# Altium project Motherboard_trimmed.PrjPcb
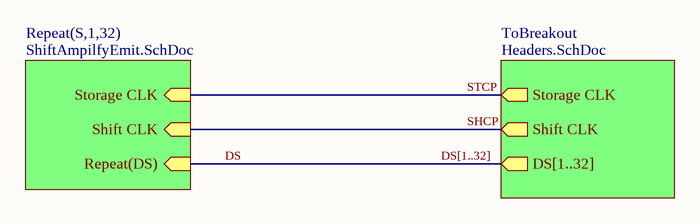
[diagram p0: Motherboard_Top_trimmed.SchDoc]
3 sheets, 610 parts. Net scope: hierarchical (ports join the sheet entries above them; power ports are global).
Board file: Motherboard_PCB_Trimmed.PcbDoc
Sheets:
  Motherboard_Top_trimmed.SchDoc
    S1 = ShiftAmpilfyEmit.SchDoc
    S2 = ShiftAmpilfyEmit.SchDoc
    S3 = ShiftAmpilfyEmit.SchDoc
    S4 = ShiftAmpilfyEmit.SchDoc
    S5 = ShiftAmpilfyEmit.SchDoc
    S6 = ShiftAmpilfyEmit.SchDoc
    S7 = ShiftAmpilfyEmit.SchDoc
    S8 = ShiftAmpilfyEmit.SchDoc
    S9 = ShiftAmpilfyEmit.SchDoc
    S10 = ShiftAmpilfyEmit.SchDoc
    S11 = ShiftAmpilfyEmit.SchDoc
    S12 = ShiftAmpilfyEmit.SchDoc
    S13 = ShiftAmpilfyEmit.SchDoc
    S14 = ShiftAmpilfyEmit.SchDoc
    S15 = ShiftAmpilfyEmit.SchDoc
    S16 = ShiftAmpilfyEmit.SchDoc
    S17 = ShiftAmpilfyEmit.SchDoc
    S18 = ShiftAmpilfyEmit.SchDoc
    S19 = ShiftAmpilfyEmit.SchDoc
    S20 = ShiftAmpilfyEmit.SchDoc
    S21 = ShiftAmpilfyEmit.SchDoc
    S22 = ShiftAmpilfyEmit.SchDoc
    S23 = ShiftAmpilfyEmit.SchDoc
    S24 = ShiftAmpilfyEmit.SchDoc
    S25 = ShiftAmpilfyEmit.SchDoc
    S26 = ShiftAmpilfyEmit.SchDoc
    S27 = ShiftAmpilfyEmit.SchDoc
    S28 = ShiftAmpilfyEmit.SchDoc
    S29 = ShiftAmpilfyEmit.SchDoc
    S30 = ShiftAmpilfyEmit.SchDoc
    S31 = ShiftAmpilfyEmit.SchDoc
    S32 = ShiftAmpilfyEmit.SchDoc
    ToBreakout = Headers.SchDoc

## Sheet Motherboard_Top_trimmed.SchDoc: Interact Lab Motherboard
size A4; DrawnBy: Ben Kazemi; Engineer: Ben Kazemi; DocumentNumber: 1; Revision: 1; SheetNumber: 1; SheetTotal: 3; Number: Top; DocumentName: Interact Lab Motherboard; ProjectName: Interact Lab Motherboard

### Sub-sheets
Repeat(S,1,32) = ShiftAmpilfyEmit.SchDoc: Storage CLK (in), Shift CLK (in), Repeat(DS) (in)
ToBreakout = Headers.SchDoc: Storage CLK (out), Shift CLK (out), DS[1..32] (out)

### Nets
DS: sheet Repeat(S,1,32)/Repeat(DS)
SHCP: sheet Repeat(S,1,32)/Shift CLK, sheet ToBreakout/Shift CLK
STCP: sheet Repeat(S,1,32)/Storage CLK, sheet ToBreakout/Storage CLK

### Buses and harness runs
bus DS[1..32] = sheet ToBreakout/DS[1..32]

## Sheet ShiftAmpilfyEmit.SchDoc: Interact Lab Motherboard
size A4; DrawnBy: Ben Kazemi; DocumentNumber: 2; SheetNumber: 2; SheetTotal: 3; Number: Logic and Amplification Stage
Used 32 times, as channels S1, S2, S3, S4, S5, S6, S7, S8, S9, S10, S11, S12, S13, S14, S15, S16, S17, S18, S19, S20, S21, S22, S23, S24, S25, S26, S27, S28, S29, S30, S31, S32. Parts and nets are listed once, with the designators drawn on the sheet.
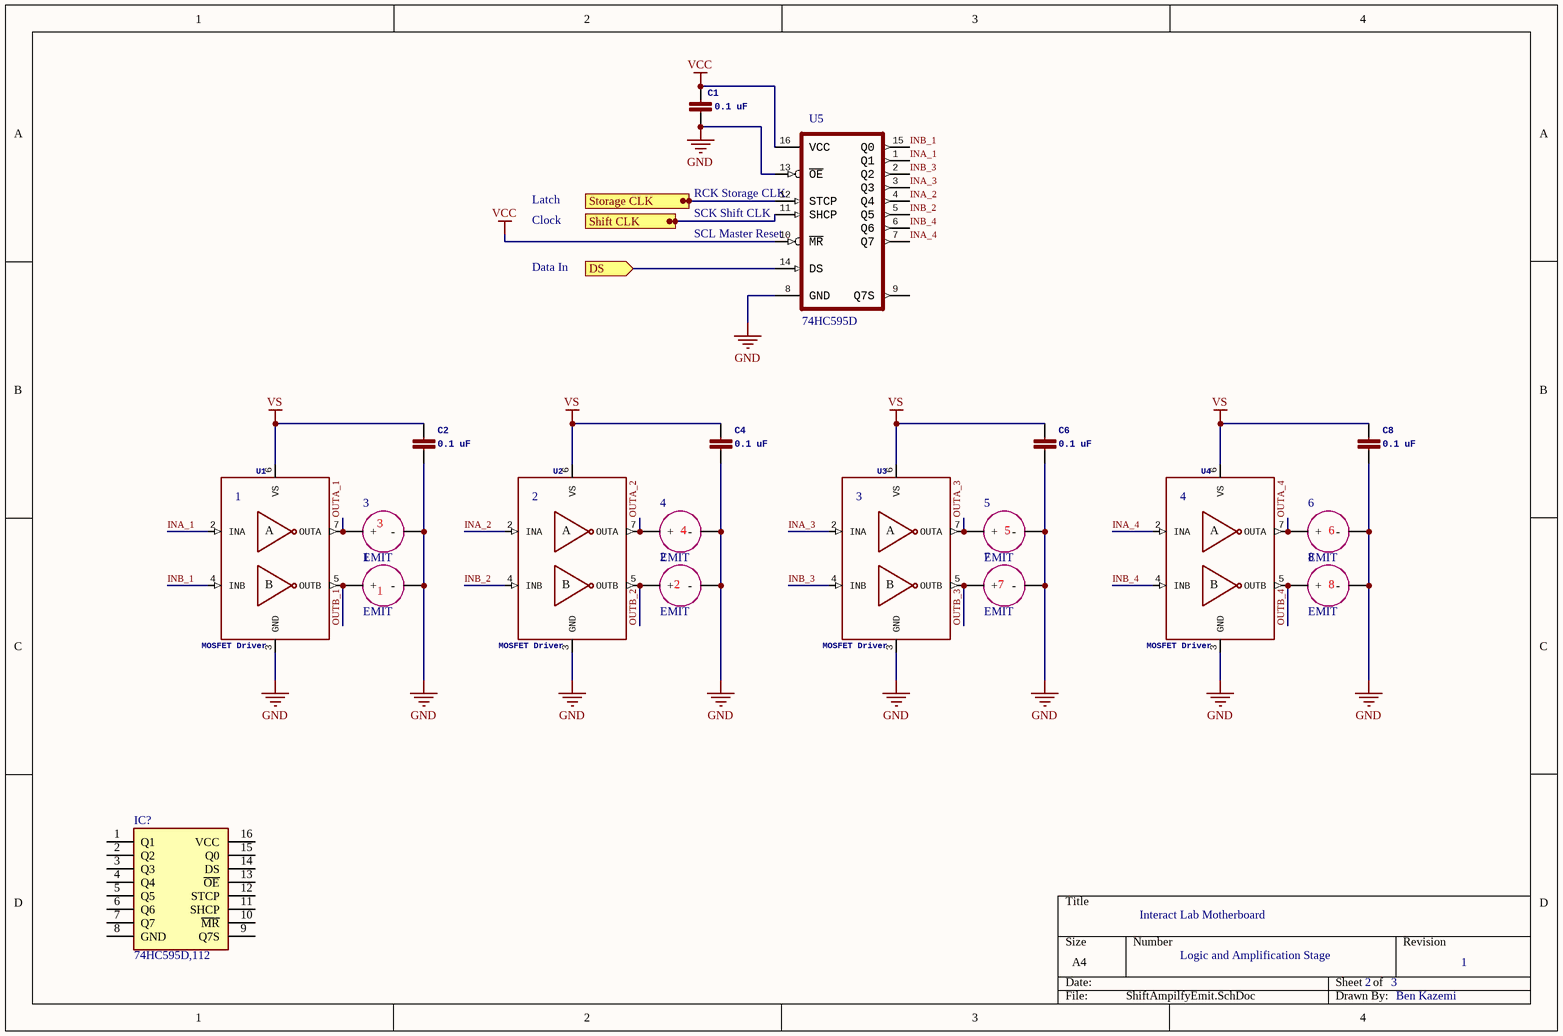
[diagram p1: ShiftAmpilfyEmit.SchDoc]

### Parts
1  EMIT  [TRANSDUCER]
2  EMIT  [TRANSDUCER]
3  EMIT  [TRANSDUCER]
4  EMIT  [TRANSDUCER]
5  EMIT  [TRANSDUCER]
6  EMIT  [TRANSDUCER]
7  EMIT  [TRANSDUCER]
8  EMIT  [TRANSDUCER]
C1  0.1 uF  [CAP0805]
C2  0.1 uF  [CAP0805]
C4  0.1 uF  [CAP0805]
C6  0.1 uF  [CAP0805]
C8  0.1 uF  [CAP0805]
IC?  74HC595D,112  [SOIC127P600X175-16N]
U1  MOSFET Driver  [MIC4127YME]
U2  MOSFET Driver  [MIC4127YME]
U3  MOSFET Driver  [MIC4127YME]
U4  MOSFET Driver  [MIC4127YME]
U5  74HC595D  [74*959D]

### Ports
DS (in), Shift CLK (in), Storage CLK (in)

### Nets
GND: 1.- 2.- 3.- 4.- 5.- 6.- 7.- 8.- C1.2 C2.2 C4.2 C6.2 C8.2 U1.3(GND) U2.3(GND) U3.3(GND) U4.3(GND) U5.8(GND) U5.13(~{OE})
VCC: C1.1 U5.10(~{MR}) U5.16(VCC)
VS: C2.1 C4.1 C6.1 C8.1 U1.6(VS) U2.6(VS) U3.6(VS) U4.6(VS)
DS: U5.14(DS) ; port DS
INA_1: U1.2(INA) U5.1(Q1)
INA_2: U2.2(INA) U5.4(Q4)
INA_3: U3.2(INA) U5.3(Q3)
INA_4: U4.2(INA) U5.7(Q7)
INB_1: U1.4(INB) U5.15(Q0)
INB_2: U2.4(INB) U5.5(Q5)
INB_3: U3.4(INB) U5.2(Q2)
INB_4: U4.4(INB) U5.6(Q6)
OUTA_1: 3.+ U1.7(OUTA)
OUTA_2: 4.+ U2.7(OUTA)
OUTA_3: 5.+ U3.7(OUTA)
OUTA_4: 6.+ U4.7(OUTA)
OUTB_1: 1.+ U1.5(OUTB)
OUTB_2: 2.+ U2.5(OUTB)
OUTB_3: 7.+ U3.5(OUTB)
OUTB_4: 8.+ U4.5(OUTB)
Shift CLK: U5.11(SHCP) ; port Shift CLK
Storage CLK: U5.12(STCP) ; port Storage CLK

Not connected (* = marked no-connect by the designer): IC? 1(Q1) 2(Q2) 3(Q3) 4(Q4) 5(Q5) 6(Q6) 7(Q7) 8(GND) 9(Q7S) 10(~{MR}) 11(SHCP) 12(STCP) 13(~{OE}) 14(DS) 15(Q0) 16(VCC); U5 9(Q7S)

### Channels
S1: designators end in A; ports DS=DS1 Shift CLK=SHCP Storage CLK=STCP
S2: designators end in B; ports DS=DS2 Shift CLK=SHCP Storage CLK=STCP
S3: designators end in C; ports DS=DS3 Shift CLK=SHCP Storage CLK=STCP
S4: designators end in D; ports DS=DS4 Shift CLK=SHCP Storage CLK=STCP
S5: designators end in E; ports DS=DS5 Shift CLK=SHCP Storage CLK=STCP
S6: designators end in F; ports DS=DS6 Shift CLK=SHCP Storage CLK=STCP
S7: designators end in G; ports DS=DS7 Shift CLK=SHCP Storage CLK=STCP
S8: designators end in H; ports DS=DS8 Shift CLK=SHCP Storage CLK=STCP
S9: designators end in I; ports DS=DS9 Shift CLK=SHCP Storage CLK=STCP
S10: designators end in J; ports DS=DS10 Shift CLK=SHCP Storage CLK=STCP
S11: designators end in K; ports DS=DS11 Shift CLK=SHCP Storage CLK=STCP
S12: designators end in L; ports DS=DS12 Shift CLK=SHCP Storage CLK=STCP
S13: designators end in M; ports DS=DS13 Shift CLK=SHCP Storage CLK=STCP
S14: designators end in N; ports DS=DS14 Shift CLK=SHCP Storage CLK=STCP
S15: designators end in O; ports DS=DS15 Shift CLK=SHCP Storage CLK=STCP
S16: designators end in P; ports DS=DS16 Shift CLK=SHCP Storage CLK=STCP
S17: designators end in Q; ports DS=DS17 Shift CLK=SHCP Storage CLK=STCP
S18: designators end in R; ports DS=DS18 Shift CLK=SHCP Storage CLK=STCP
S19: designators end in S; ports DS=DS19 Shift CLK=SHCP Storage CLK=STCP
S20: designators end in T; ports DS=DS20 Shift CLK=SHCP Storage CLK=STCP
S21: designators end in U; ports DS=DS21 Shift CLK=SHCP Storage CLK=STCP
S22: designators end in V; ports DS=DS22 Shift CLK=SHCP Storage CLK=STCP
S23: designators end in W; ports DS=DS23 Shift CLK=SHCP Storage CLK=STCP
S24: designators end in X; ports DS=DS24 Shift CLK=SHCP Storage CLK=STCP
S25: designators end in Y; ports DS=DS25 Shift CLK=SHCP Storage CLK=STCP
S26: designators end in Z; ports DS=DS26 Shift CLK=SHCP Storage CLK=STCP
S27: designators end in 27; ports DS=DS27 Shift CLK=SHCP Storage CLK=STCP
S28: designators end in 28; ports DS=DS28 Shift CLK=SHCP Storage CLK=STCP
S29: designators end in 29; ports DS=DS29 Shift CLK=SHCP Storage CLK=STCP
S30: designators end in 30; ports DS=DS30 Shift CLK=SHCP Storage CLK=STCP
S31: designators end in 31; ports DS=DS31 Shift CLK=SHCP Storage CLK=STCP
S32: designators end in 32; ports DS=DS32 Shift CLK=SHCP Storage CLK=STCP

### Notes on the sheet
- Latch
- Clock
- (near U5) SCL Master Reset
- (near U5) SCK Shift CLK
- (near U5) RCK Storage CLK
- Data In
- (near U1) 1
- (near U2) 2
- (near U3) 3
- (near U4) 4
- (near 3) 3
- (near 4) 4
- (near 5) 5
- (near 6) 6
- (near 1) 1
- (near 2) 2
- (near 7) 7
- (near 8) 8
- 1
- (in symbol MIC4127) A; B

### Library data of the parts
C1 C2 C4 C6 C8 = CAP CERAMIC: PROD_ID: CAP-08280
IC? = 74HC595D,112: Integrated Circuit; Manufacturer_Name: Nexperia; Datasheet Link: https://assets.nexperia.com/documents/data-sheet/74HC_HCT595.pdf; Height: 1.75mm; Manufacturer_Part_Number: 74HC595D,112; Mouser Part Number: 771-74HC595D; Mouser Price/Stock: https://www.mouser.co.uk/ProductDetail/Nexperia/74HC595D112?qs=P62ublwmbi9CWen68lvwew%3D%3D; Arrow Part Number: 74HC595D,112; Arrow Price/Stock: https://www.arrow.com/en/products/74hc595d112/nexperia?region=nac
U1-U4 = MIC4127
U5 = 74HC595D,118: Logic IC - Shift register NXP Semiconductors 74HC595D, 118 Shift register Three-state SO 16; MF: Nexperia USA; SnapEDA_Link: https://www.snapeda.com/parts/74HC595D%2C118/Nexperia%20USA%20Inc./view-part/?ref=snap; Availability: Unavailable; Price: None; MP: 74HC595D,118; Package: SO-16 Nexperia; Value: *

## Sheet Headers.SchDoc: Interact Lab Motherboard
size A4; DrawnBy: Ben Kazemi; DocumentNumber: 3; Revision: 1; SheetNumber: 3; SheetTotal: 3; PageSetup: Record=PageOptions|CenterHorizontal=True|CenterVertical=True|PrintScale=0.54|XCorrection=1.00|YCorrection=1.00|PrintKind=0|BorderSize=5000000|LeftOffset=0|BottomOffset=0|Orientation=2|PaperLength=1000|PaperWidth=1000|Scale=100|PaperSource=7|PrintQuality=-4|MediaType=1|DitherType=10|PaperKind=Letter|PrintScaleMode=1; Number: Headers to Daughterboard
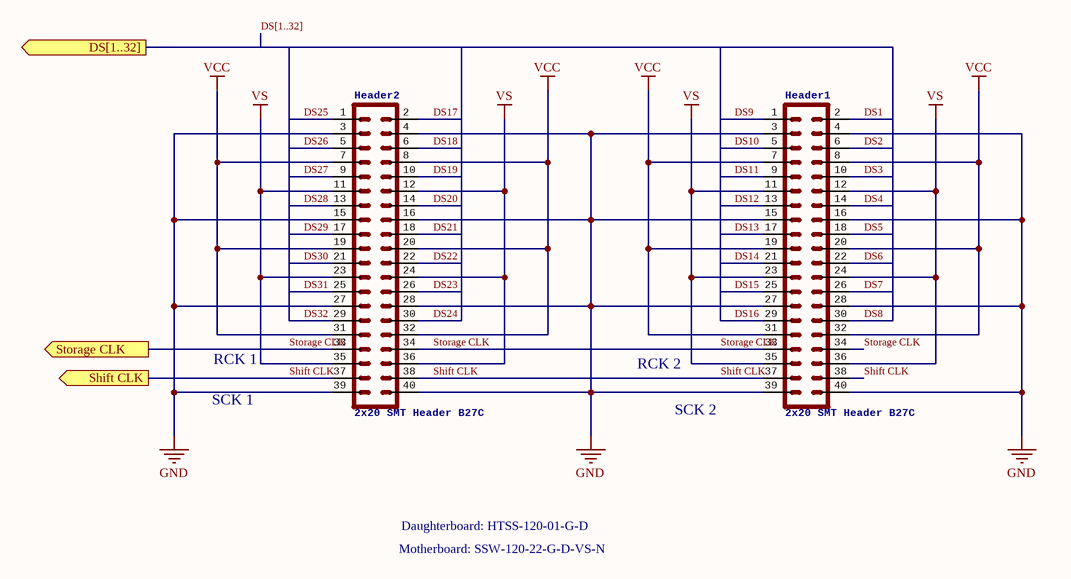
[diagram p2: Headers.SchDoc]

### Parts
Header1  2x20 SMT Header B27C  [B27C-SMT2x20]
Header2  2x20 SMT Header B27C  [B27C-SMT2x20]

### Ports
DS[1..32] (out), Shift CLK (out), Storage CLK (out)

### Nets
GND: Header1.3 Header1.4 Header1.15 Header1.16 Header1.27 Header1.28 Header1.39 Header1.40 Header2.3 Header2.4 Header2.15 Header2.16 Header2.27 Header2.28 Header2.39 Header2.40
VCC: Header1.7 Header1.8 Header1.19 Header1.20 Header1.31 Header1.32 Header2.7 Header2.8 Header2.19 Header2.20 Header2.31 Header2.32
VS: Header1.11 Header1.12 Header1.23 Header1.24 Header1.35 Header1.36 Header2.11 Header2.12 Header2.23 Header2.24 Header2.35 Header2.36
DS1: Header1.2
DS2: Header1.6
DS3: Header1.10
DS4: Header1.14
DS5: Header1.18
DS6: Header1.22
DS7: Header1.26
DS8: Header1.30
DS9: Header1.1
DS10: Header1.5
DS11: Header1.9
DS12: Header1.13
DS13: Header1.17
DS14: Header1.21
DS15: Header1.25
DS16: Header1.29
DS17: Header2.2
DS18: Header2.6
DS19: Header2.10
DS20: Header2.14
DS21: Header2.18
DS22: Header2.22
DS23: Header2.26
DS24: Header2.30
DS25: Header2.1
DS26: Header2.5
DS27: Header2.9
DS28: Header2.13
DS29: Header2.17
DS30: Header2.21
DS31: Header2.25
DS32: Header2.29
Shift CLK: Header1.37 Header1.38 Header2.37 Header2.38 ; port Shift CLK  [project net SHCP]
Storage CLK: Header1.33 Header1.34 Header2.33 Header2.34 ; port Storage CLK  [project net STCP]

### Buses and harness runs
bus DS[1..32] = port DS[1..32]

### Notes on the sheet
- RCK 1
- RCK 2
- SCK 1
- SCK 2
- Motherboard: SSW-120-22-G-D-VS-N
- Daughterboard: HTSS-120-01-G-D

### Library data of the parts
Header1 Header2 = CONN_20X2SHROUDED_SMT: PROD_ID: B27C-2X20-BSBB1-G

## Nets that join several sheets
GND: S1 (19 pins), S2 (19 pins), S3 (19 pins), S4 (19 pins), S5 (19 pins), S6 (19 pins), S7 (19 pins), S8 (19 pins), S9 (19 pins), S10 (19 pins), S11 (19 pins), S12 (19 pins), S13 (19 pins), S14 (19 pins), S15 (19 pins), S16 (19 pins), S17 (19 pins), S18 (19 pins), S19 (19 pins), S20 (19 pins), S21 (19 pins), S22 (19 pins), S23 (19 pins), S24 (19 pins), S25 (19 pins), S26 (19 pins), S27 (19 pins), S28 (19 pins), S29 (19 pins), S30 (19 pins), S31 (19 pins), S32 (19 pins), Headers (16 pins)
VCC: S1 (C1A.1 U5A.10 U5A.16), S2 (C1B.1 U5B.10 U5B.16), S3 (C1C.1 U5C.10 U5C.16), S4 (C1D.1 U5D.10 U5D.16), S5 (C1E.1 U5E.10 U5E.16), S6 (C1F.1 U5F.10 U5F.16), S7 (C1G.1 U5G.10 U5G.16), S8 (C1H.1 U5H.10 U5H.16), S9 (C1I.1 U5I.10 U5I.16), S10 (C1J.1 U5J.10 U5J.16), S11 (C1K.1 U5K.10 U5K.16), S12 (C1L.1 U5L.10 U5L.16), S13 (C1M.1 U5M.10 U5M.16), S14 (C1N.1 U5N.10 U5N.16), S15 (C1O.1 U5O.10 U5O.16), S16 (C1P.1 U5P.10 U5P.16), S17 (C1Q.1 U5Q.10 U5Q.16), S18 (C1R.1 U5R.10 U5R.16), S19 (C1S.1 U5S.10 U5S.16), S20 (C1T.1 U5T.10 U5T.16), S21 (C1U.1 U5U.10 U5U.16), S22 (C1V.1 U5V.10 U5V.16), S23 (C1W.1 U5W.10 U5W.16), S24 (C1X.1 U5X.10 U5X.16), S25 (C1Y.1 U5Y.10 U5Y.16), S26 (C1Z.1 U5Z.10 U5Z.16), S27 (C127.1 U527.10 U527.16), S28 (C128.1 U528.10 U528.16), S29 (C129.1 U529.10 U529.16), S30 (C130.1 U530.10 U530.16), S31 (C131.1 U531.10 U531.16), S32 (C132.1 U532.10 U532.16), Headers (12 pins)
VS: S1 (8 pins), S2 (8 pins), S3 (8 pins), S4 (8 pins), S5 (8 pins), S6 (8 pins), S7 (8 pins), S8 (8 pins), S9 (8 pins), S10 (8 pins), S11 (8 pins), S12 (8 pins), S13 (8 pins), S14 (8 pins), S15 (8 pins), S16 (8 pins), S17 (8 pins), S18 (8 pins), S19 (8 pins), S20 (8 pins), S21 (8 pins), S22 (8 pins), S23 (8 pins), S24 (8 pins), S25 (8 pins), S26 (8 pins), S27 (8 pins), S28 (8 pins), S29 (8 pins), S30 (8 pins), S31 (8 pins), S32 (8 pins), Headers (12 pins)
DS1: S1 (U5A.14), Headers (Header1.2)
DS2: S2 (U5B.14), Headers (Header1.6)
DS3: S3 (U5C.14), Headers (Header1.10)
DS4: S4 (U5D.14), Headers (Header1.14)
DS5: S5 (U5E.14), Headers (Header1.18)
DS6: S6 (U5F.14), Headers (Header1.22)
DS7: S7 (U5G.14), Headers (Header1.26)
DS8: S8 (U5H.14), Headers (Header1.30)
DS9: S9 (U5I.14), Headers (Header1.1)
DS10: S10 (U5J.14), Headers (Header1.5)
DS11: S11 (U5K.14), Headers (Header1.9)
DS12: S12 (U5L.14), Headers (Header1.13)
DS13: S13 (U5M.14), Headers (Header1.17)
DS14: S14 (U5N.14), Headers (Header1.21)
DS15: S15 (U5O.14), Headers (Header1.25)
DS16: S16 (U5P.14), Headers (Header1.29)
DS17: S17 (U5Q.14), Headers (Header2.2)
DS18: S18 (U5R.14), Headers (Header2.6)
DS19: S19 (U5S.14), Headers (Header2.10)
DS20: S20 (U5T.14), Headers (Header2.14)
DS21: S21 (U5U.14), Headers (Header2.18)
DS22: S22 (U5V.14), Headers (Header2.22)
DS23: S23 (U5W.14), Headers (Header2.26)
DS24: S24 (U5X.14), Headers (Header2.30)
DS25: S25 (U5Y.14), Headers (Header2.1)
DS26: S26 (U5Z.14), Headers (Header2.5)
DS27: S27 (U527.14), Headers (Header2.9)
DS28: S28 (U528.14), Headers (Header2.13)
DS29: S29 (U529.14), Headers (Header2.17)
DS30: S30 (U530.14), Headers (Header2.21)
DS31: S31 (U531.14), Headers (Header2.25)
DS32: S32 (U532.14), Headers (Header2.29)
SHCP: S1 (U5A.11), S2 (U5B.11), S3 (U5C.11), S4 (U5D.11), S5 (U5E.11), S6 (U5F.11), S7 (U5G.11), S8 (U5H.11), S9 (U5I.11), S10 (U5J.11), S11 (U5K.11), S12 (U5L.11), S13 (U5M.11), S14 (U5N.11), S15 (U5O.11), S16 (U5P.11), S17 (U5Q.11), S18 (U5R.11), S19 (U5S.11), S20 (U5T.11), S21 (U5U.11), S22 (U5V.11), S23 (U5W.11), S24 (U5X.11), S25 (U5Y.11), S26 (U5Z.11), S27 (U527.11), S28 (U528.11), S29 (U529.11), S30 (U530.11), S31 (U531.11), S32 (U532.11), Headers (Header1.37 Header1.38 Header2.37 Header2.38)
STCP: S1 (U5A.12), S2 (U5B.12), S3 (U5C.12), S4 (U5D.12), S5 (U5E.12), S6 (U5F.12), S7 (U5G.12), S8 (U5H.12), S9 (U5I.12), S10 (U5J.12), S11 (U5K.12), S12 (U5L.12), S13 (U5M.12), S14 (U5N.12), S15 (U5O.12), S16 (U5P.12), S17 (U5Q.12), S18 (U5R.12), S19 (U5S.12), S20 (U5T.12), S21 (U5U.12), S22 (U5V.12), S23 (U5W.12), S24 (U5X.12), S25 (U5Y.12), S26 (U5Z.12), S27 (U527.12), S28 (U528.12), S29 (U529.12), S30 (U530.12), S31 (U531.12), S32 (U532.12), Headers (Header1.33 Header1.34 Header2.33 Header2.34)